# Altium project VM03_hv6.PrjPcb (part 2 of 2)
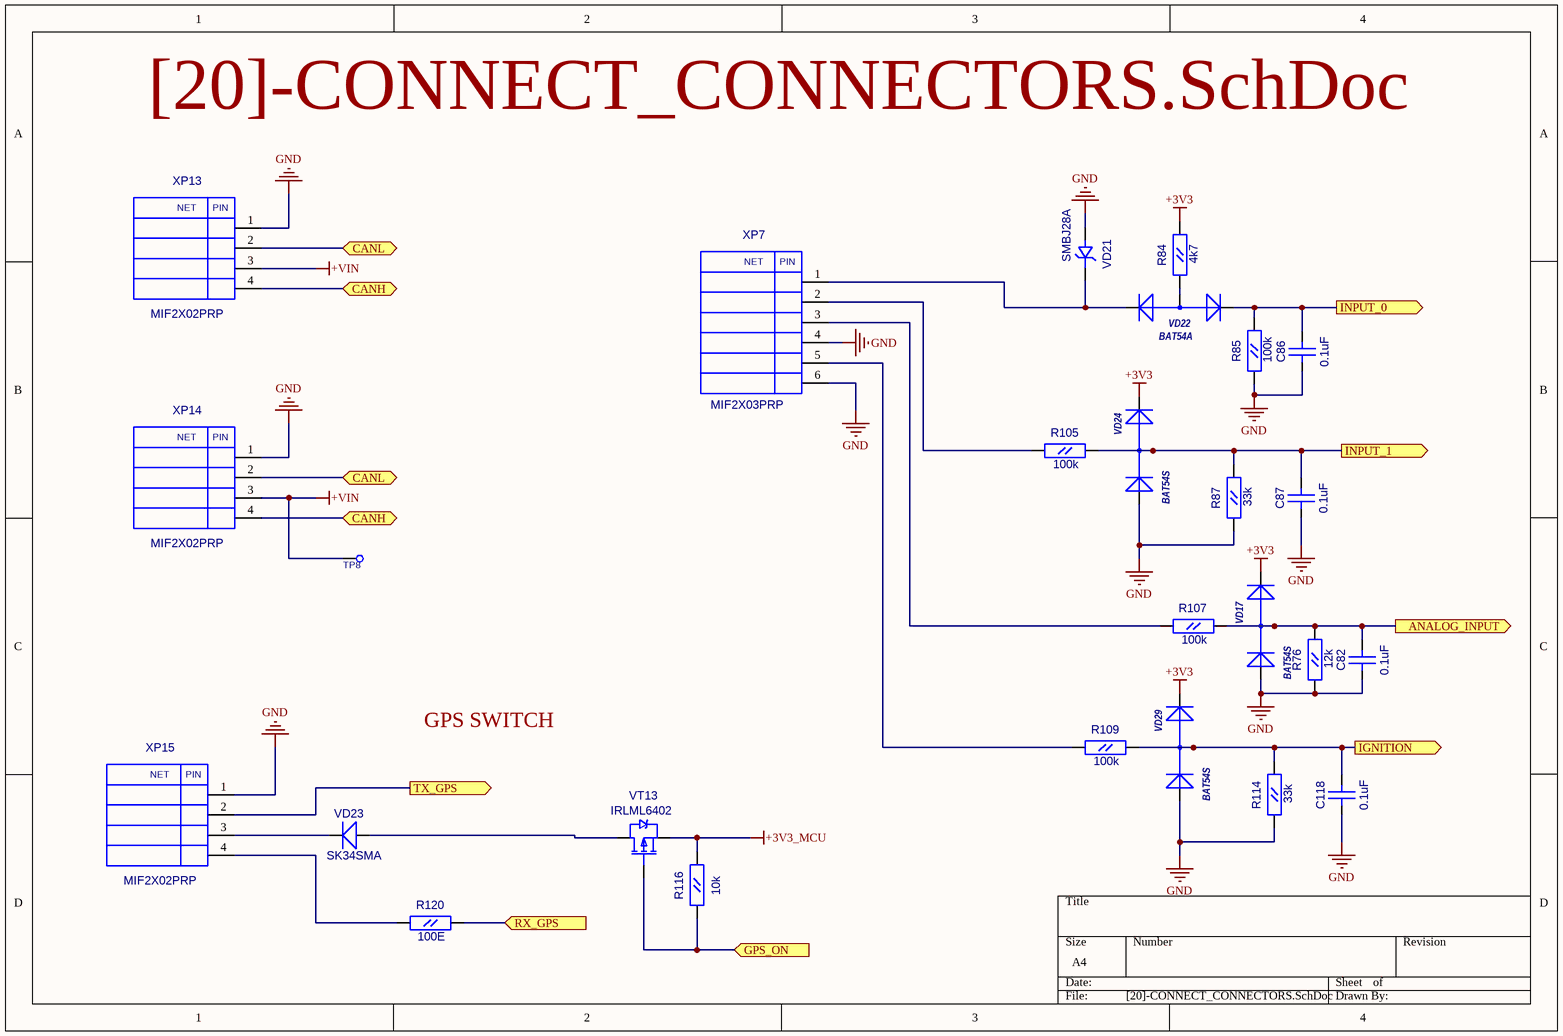
[diagram p19: [20]-CONNECT_CONNECTORS.SchDoc]

## Nets that join several sheets
+3V3: [3]-MCU_MAIN (DD2.3), [20]-CONNECT_CONNECTORS (R84.2 VD17.2 VD24.2 VD29.2)
+3V3_ETH: [14]-CURRENT_METER (C45.1 DA5.4), [16]-ETH_SWITCH (5 pins)
+3V3_MCU: [3]-MCU_MAIN (10 pins), [4]-MCU_POWER (5 pins), [5]-MCU_CONNECTORS (R11.1 R12.1), [15]-CLOCK (R52.2 R53.2 VD15.1), [20]-CONNECT_CONNECTORS (R116.2 VT13.2)
+3V9: [8]-MODEM_MAIN (XP10.3 XP10.4 XP10.13 XP10.14), [9]-MODEM_POWER (C22.1 C23.1 L2.2 R20.2)
+5V3: [7]-H3_POWER (5 pins), [13]-BACKUP_POWER (R73.1 VD28.1 VD38.1), [16]-ETH_SWITCH (C112.2 C113.1 DA8.1), [18]-WIFI_MODULE (C116.2 C117.1 DA9.1)
+11V_VCAM: [12]-CAMERA_POWER (VD18.2 VT3.2), [19]-CAMERA_PWR_CONNECTORS (16 pins)
+VIN: [11]-MAIN_POWER (C46.2 L6.1), [20]-CONNECT_CONNECTORS (TP8.1 XP13.3 XP14.3)
+VIN_F: [4]-MCU_POWER (R5.1), [7]-H3_POWER (C18.2 C19.1 DA2.2), [9]-MODEM_POWER (C24.2 C25.1 DA3.2), [11]-MAIN_POWER (VT19.2), [12]-CAMERA_POWER (5 pins)
CAM1_GND: [14]-CURRENT_METER (DA5.3 R45.1), [17]-ETH_CONNECTOR (XP8.7A XP8.8A)
CAM2_GND: [14]-CURRENT_METER (DA5.5 R44.1), [17]-ETH_CONNECTOR (XP8.7B XP8.8B)
CAM3_GND: [14]-CURRENT_METER (DA5.10 R50.1), [17]-ETH_CONNECTOR (XP8.7C XP8.8C)
CAM4_GND: [14]-CURRENT_METER (DA5.12 R51.1), [17]-ETH_CONNECTOR (XP8.7D XP8.8D)
GND: [3]-MCU_MAIN (14 pins), [4]-MCU_POWER (9 pins), [5]-MCU_CONNECTORS (6 pins), [6]-H3_MAIN (12 pins), [7]-H3_POWER (16 pins), [8]-MODEM_MAIN (10 pins), [9]-MODEM_POWER (13 pins), [10]-MODEM_CONNECTORS (13 pins), [11]-MAIN_POWER (6 pins), [12]-CAMERA_POWER (15 pins), [13]-BACKUP_POWER (19 pins), [14]-CURRENT_METER (14 pins), [15]-CLOCK (5 pins), [16]-ETH_SWITCH (27 pins), [17]-ETH_CONNECTOR (20 pins), [18]-WIFI_MODULE (8 pins), [19]-CAMERA_PWR_CONNECTORS (16 pins), [20]-CONNECT_CONNECTORS (17 pins)
V_AUX: [8]-MODEM_MAIN (XP5.11), [10]-MODEM_CONNECTORS (R29.1)
VUSB: [3]-MCU_MAIN (C3.2 DD1.20), [4]-MCU_POWER (C11.2 C12.1 DA1.1 DA1.3), [6]-H3_MAIN (6 pins), [7]-H3_POWER (R15.2 VT1.2), [8]-MODEM_MAIN (XP5.13), [13]-BACKUP_POWER (12 pins)
ANALOG_INPUT: [3]-MCU_MAIN (DD1.30), [20]-CONNECT_CONNECTORS (C82.2 R76.2 R107.2 VD17.3)
CAM0_LED: [6]-H3_MAIN (M1.15), [17]-ETH_CONNECTOR (R64.2)
CAM1_LED: [6]-H3_MAIN (M1.17), [17]-ETH_CONNECTOR (R95.2)
CAM1_ON: [3]-MCU_MAIN (DD1.9), [19]-CAMERA_PWR_CONNECTORS (R102.2)
CAM2_LED: [6]-H3_MAIN (M1.19), [17]-ETH_CONNECTOR (R63.2)
CAM2_ON: [3]-MCU_MAIN (DD1.11), [19]-CAMERA_PWR_CONNECTORS (R118.2)
CAM3_LED: [6]-H3_MAIN (M1.21), [17]-ETH_CONNECTOR (R94.2)
CAM3_ON: [3]-MCU_MAIN (DD1.12), [19]-CAMERA_PWR_CONNECTORS (R103.2)
CAM4_ON: [3]-MCU_MAIN (DD1.13), [19]-CAMERA_PWR_CONNECTORS (R104.2)
CANH: [3]-MCU_MAIN (DD1.19), [5]-MCU_CONNECTORS (FU2.1 R9.2 VD2.1)
CANL: [3]-MCU_MAIN (DD1.18), [5]-MCU_CONNECTORS (FU1.1 J1.1 VD2.2)
CURRENT_CAM1: [3]-MCU_MAIN (DD1.33), [14]-CURRENT_METER (C49.2 R75.2)
CURRENT_CAM2: [3]-MCU_MAIN (DD1.34), [14]-CURRENT_METER (C51.2 R83.2)
CURRENT_CAM3: [3]-MCU_MAIN (DD1.42), [14]-CURRENT_METER (C52.2 R90.2)
CURRENT_CAM4: [3]-MCU_MAIN (DD1.40), [14]-CURRENT_METER (C53.2 R91.2)
GSM_ON: [6]-H3_MAIN (M1.13), [9]-MODEM_POWER (DA3.3 R23.1)
GSM_RST: [6]-H3_MAIN (M1.59), [8]-MODEM_MAIN (XP10.6)
INPUT_0: [3]-MCU_MAIN (DD1.25), [6]-H3_MAIN (M1.60), [20]-CONNECT_CONNECTORS (C86.2 R85.2 VD22.2)
INPUT_1: [6]-H3_MAIN (M1.62), [20]-CONNECT_CONNECTORS (C87.2 R87.2 R105.2 VD24.3)
ISP_START: [3]-MCU_MAIN (DD1.4), [5]-MCU_CONNECTORS (C13.2 J2.2 R11.2)
LED1_ON: [6]-H3_MAIN (M1.63), [19]-CAMERA_PWR_CONNECTORS (R111.2)
LED2_ON: [6]-H3_MAIN (M1.65), [19]-CAMERA_PWR_CONNECTORS (R119.2)
LED3_ON: [6]-H3_MAIN (M1.67), [19]-CAMERA_PWR_CONNECTORS (R112.2)
LED4_ON: [6]-H3_MAIN (M1.68), [19]-CAMERA_PWR_CONNECTORS (R113.2)
MCU_RXD: [3]-MCU_MAIN (DD1.46), [5]-MCU_CONNECTORS (XP1.3), [6]-H3_MAIN (M1.55)
MCU_TXD: [3]-MCU_MAIN (DD1.47), [5]-MCU_CONNECTORS (R10.2), [6]-H3_MAIN (M1.66)
MODEM_STATUS: [6]-H3_MAIN (M1.51), [8]-MODEM_MAIN (XP10.11)
NetC118_2: [3]-MCU_MAIN (DD1.24), [20]-CONNECT_CONNECTORS (C118.2 R109.2 R114.2 VD29.3)
NetDA8_3: [6]-H3_MAIN (M1.38), [16]-ETH_SWITCH (DA8.3 R82.2)
NetDD4_2: [16]-ETH_SWITCH (DD4.2), [17]-ETH_CONNECTOR (TR2.15)
NetDD4_3: [16]-ETH_SWITCH (DD4.3), [17]-ETH_CONNECTOR (TR2.13)
NetDD4_4: [16]-ETH_SWITCH (DD4.4), [17]-ETH_CONNECTOR (TR2.16)
NetDD4_5: [16]-ETH_SWITCH (DD4.5), [17]-ETH_CONNECTOR (TR2.18)
NetDD4_9: [16]-ETH_SWITCH (DD4.9), [17]-ETH_CONNECTOR (TR1.24)
NetDD4_10: [16]-ETH_SWITCH (DD4.10), [17]-ETH_CONNECTOR (TR1.22)
NetDD4_11: [16]-ETH_SWITCH (DD4.11), [17]-ETH_CONNECTOR (TR1.19)
NetDD4_12: [16]-ETH_SWITCH (DD4.12), [17]-ETH_CONNECTOR (TR1.21)
NetDD4_14: [16]-ETH_SWITCH (DD4.14), [17]-ETH_CONNECTOR (TR1.15)
NetDD4_15: [16]-ETH_SWITCH (DD4.15), [17]-ETH_CONNECTOR (TR1.13)
NetDD4_16: [16]-ETH_SWITCH (DD4.16), [17]-ETH_CONNECTOR (TR1.16)
NetDD4_17: [16]-ETH_SWITCH (DD4.17), [17]-ETH_CONNECTOR (TR1.18)
NetDD4_19: [6]-H3_MAIN (M1.27), [16]-ETH_SWITCH (DD4.19)
NetDD4_20: [6]-H3_MAIN (M1.28), [16]-ETH_SWITCH (DD4.20)
NetDD4_21: [6]-H3_MAIN (M1.30), [16]-ETH_SWITCH (DD4.21)
NetDD4_22: [6]-H3_MAIN (M1.29), [16]-ETH_SWITCH (DD4.22)
NetDD4_29: [16]-ETH_SWITCH (DD4.29), [17]-ETH_CONNECTOR (R58.2)
NetDD4_30: [16]-ETH_SWITCH (DD4.30), [17]-ETH_CONNECTOR (R72.2)
NetDD4_32: [16]-ETH_SWITCH (DD4.32), [17]-ETH_CONNECTOR (R57.2)
NetDD4_33: [16]-ETH_SWITCH (DD4.33), [17]-ETH_CONNECTOR (R71.2)
NetDD4_44: [16]-ETH_SWITCH (DD4.44), [17]-ETH_CONNECTOR (TR2.21)
NetDD4_45: [16]-ETH_SWITCH (DD4.45), [17]-ETH_CONNECTOR (TR2.19)
NetDD4_46: [16]-ETH_SWITCH (DD4.46), [17]-ETH_CONNECTOR (TR2.22)
NetDD4_47: [16]-ETH_SWITCH (DD4.47), [17]-ETH_CONNECTOR (TR2.24)
NetFU1_2: [5]-MCU_CONNECTORS (FU1.2), [20]-CONNECT_CONNECTORS (XP13.2 XP14.2)
NetFU2_2: [5]-MCU_CONNECTORS (FU2.2), [20]-CONNECT_CONNECTORS (XP13.4 XP14.4)
NetM1_37: [6]-H3_MAIN (M1.37), [7]-H3_POWER (XP2.3)
NetM1_39: [6]-H3_MAIN (M1.39), [7]-H3_POWER (XP2.2)
NetM1_56: [6]-H3_MAIN (M1.56), [20]-CONNECT_CONNECTORS (R116.1 VT13.1)
NetVD30_2: [17]-ETH_CONNECTOR (XP8.4C), [19]-CAMERA_PWR_CONNECTORS (VD30.2 VT6.3)
NetVD31_2: [17]-ETH_CONNECTOR (XP8.4D), [19]-CAMERA_PWR_CONNECTORS (VD31.2 VT7.3)
NetVD32_2: [17]-ETH_CONNECTOR (XP8.4A), [19]-CAMERA_PWR_CONNECTORS (VD32.2 VT5.3)
NetVD33_2: [17]-ETH_CONNECTOR (XP8.5C), [19]-CAMERA_PWR_CONNECTORS (VD33.2 VT9.3)
NetVD34_2: [17]-ETH_CONNECTOR (XP8.5D), [19]-CAMERA_PWR_CONNECTORS (VD34.2 VT10.3)
NetVD35_2: [17]-ETH_CONNECTOR (XP8.5A), [19]-CAMERA_PWR_CONNECTORS (VD35.2 VT8.3)
NetVD36_2: [17]-ETH_CONNECTOR (XP8.4B), [19]-CAMERA_PWR_CONNECTORS (VD36.2 VT11.3)
NetVD37_2: [17]-ETH_CONNECTOR (XP8.5B), [19]-CAMERA_PWR_CONNECTORS (VD37.2 VT12.3)
OPI_ON: [3]-MCU_MAIN (DD1.36), [7]-H3_POWER (R19.2)
PWRKEY: [6]-H3_MAIN (M1.57), [8]-MODEM_MAIN (XP10.5)
RESET: [3]-MCU_MAIN (DD1.3), [5]-MCU_CONNECTORS (C14.2 J3.2 R12.2)
RX_GPS: [6]-H3_MAIN (M1.52), [20]-CONNECT_CONNECTORS (R120.2)
SCL_RTC: [6]-H3_MAIN (M1.49), [15]-CLOCK (DD3.6 R52.1)
SDA_RTC: [6]-H3_MAIN (M1.47), [15]-CLOCK (DD3.5 R53.1)
SIM1_PRES: [8]-MODEM_MAIN (XP5.6), [10]-MODEM_CONNECTORS (R29.2 VD12.3 XP4.8)
SIMCLK1: [8]-MODEM_MAIN (XP5.2), [10]-MODEM_CONNECTORS (C38.1 VD12.6 XP4.3)
SIMCLK2: [8]-MODEM_MAIN (XP5.7), [10]-MODEM_CONNECTORS (C33.2 VD11.5 XP3.3)
SIMIO1: [8]-MODEM_MAIN (XP5.3), [10]-MODEM_CONNECTORS (C95.2 R28.1 VD12.1 XP4.6)
SIMIO2: [8]-MODEM_MAIN (XP5.9), [10]-MODEM_CONNECTORS (C31.2 R27.1 VD11.1 XP3.6)
SIMRST1: [8]-MODEM_MAIN (XP5.4), [10]-MODEM_CONNECTORS (C37.1 VD12.5 XP4.2)
SIMRST2: [8]-MODEM_MAIN (XP5.8), [10]-MODEM_CONNECTORS (C34.2 VD11.4 XP3.2)
SIMVCC1: [8]-MODEM_MAIN (XP5.5), [10]-MODEM_CONNECTORS (C39.2 R28.2 VD12.4 XP4.1)
SIMVCC2: [8]-MODEM_MAIN (XP5.10), [10]-MODEM_CONNECTORS (C32.2 R27.2 VD11.3 XP3.1)
TX_GPS: [6]-H3_MAIN (M1.54), [20]-CONNECT_CONNECTORS (XP15.2)
USB_D+: [6]-H3_MAIN (M1.3), [8]-MODEM_MAIN (XP5.15)
USB_D-: [6]-H3_MAIN (M1.5), [8]-MODEM_MAIN (XP5.14)
V_IN: [3]-MCU_MAIN (DD1.32), [4]-MCU_POWER (C10.2 R5.2 R7.2 VD1.3)
WLAN_D+: [6]-H3_MAIN (M1.7), [18]-WIFI_MODULE (M2.5)
WLAN_D-: [6]-H3_MAIN (M1.9), [18]-WIFI_MODULE (M2.4)
WLAN_EN: [6]-H3_MAIN (M1.11), [18]-WIFI_MODULE (DA9.3 R98.2)